# EAGLE design us+h (EAGLE 7.7.0)
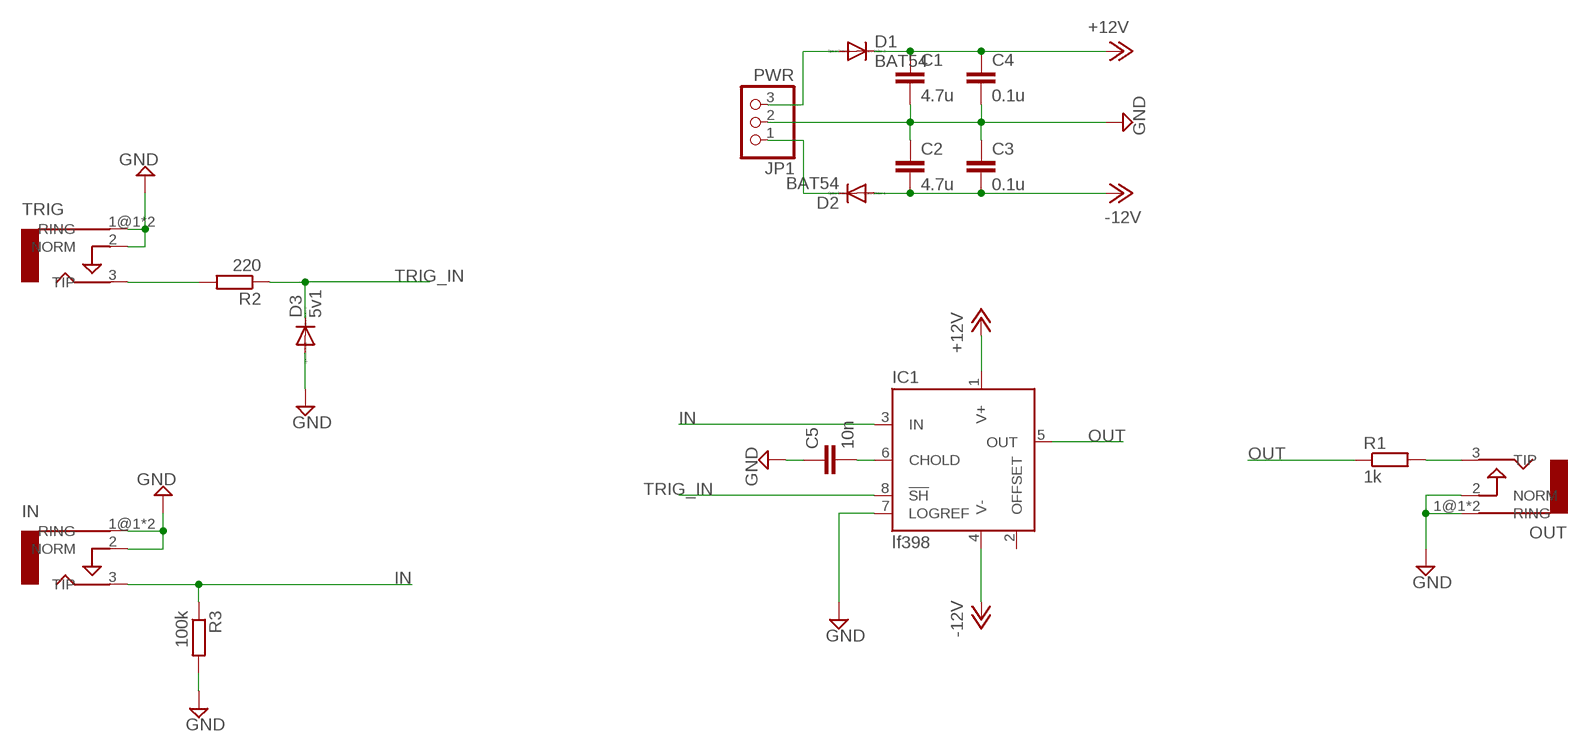
[diagram p0: schematic, sheet 1]

## Parts
C1  4.7u  C-EUC0805  [C0805]
C2  4.7u  C-EUC0805  [C0805]
C3  0.1u  C-EUC0805  [C0805]
C4  0.1u  C-EUC0805  [C0805]
C5  10n  C-EU050-025X075  [C050-025X075]
D1  BAT54  DIODE-SOD323-W  [SOD323-W]
D2  BAT54  DIODE-SOD323-W  [SOD323-W]
D3  5v1  DIODE-SOD323-W  [SOD323-W]
IC1  lf398  LF398AD  [SO08]
IN  in  AUDIO-JACKERTHENVAR  [ERTHENVAR-JACK]
JP1  PWR  PINHD-1X3  [1X03]
OUT  out  AUDIO-JACKERTHENVAR  [ERTHENVAR-JACK]
R1  1k  R-EU_R0805  [R0805]
R2  220  R-EU_R0805  [R0805]
R3  100k  R-EU_R0805  [R0805]
TRIG  trig  AUDIO-JACKERTHENVAR  [ERTHENVAR-JACK]

## Nets
+12: D1.A JP1.3
+12V: C1.1 C4.1 D1.C IC1.1(V+)
-12: D2.C JP1.1
-12V: C2.2 C3.2 D2.A IC1.4(V-)
GND: C1.2 C2.1 C3.1 C4.2 C5.1 D3.A IC1.7(LOGREF) IN.1@1(RING) IN.1@2(RING) IN.2(NORM) JP1.2 OUT.1@1(RING) OUT.1@2(RING) OUT.2(NORM) R3.2 TRIG.1@1(RING) TRIG.1@2(RING) TRIG.2(NORM)
IN: IC1.3(IN) IN.3(TIP) R3.1
N$5: C5.2 IC1.6(CHOLD)
N$6: R2.2 TRIG.3(TIP)
N$8: OUT.3(TIP) R1.2
OUT: IC1.5(OUT) R1.1
TRIG_IN: D3.C IC1.8(!SH) R2.1
Unconnected: IC1.2(OFFSET)

## Library data of the parts
C1-C5 = rcl:C-EU: CAPACITOR, European symbol
D1-D3 = diode:DIODE-: DIODE
IC1 = linear:LF398A: SAMPLE&HOLD AMPLIFIER
IN OUT TRIG = erthenvar:AUDIO-JACK: Switching Mono 3.5mm Audio Jack from Erthenvar.
JP1 = pinhead:PINHD-1X3: PIN HEADER
R1-R3 = rcl:R-EU_: RESISTOR, European symbol

## Board
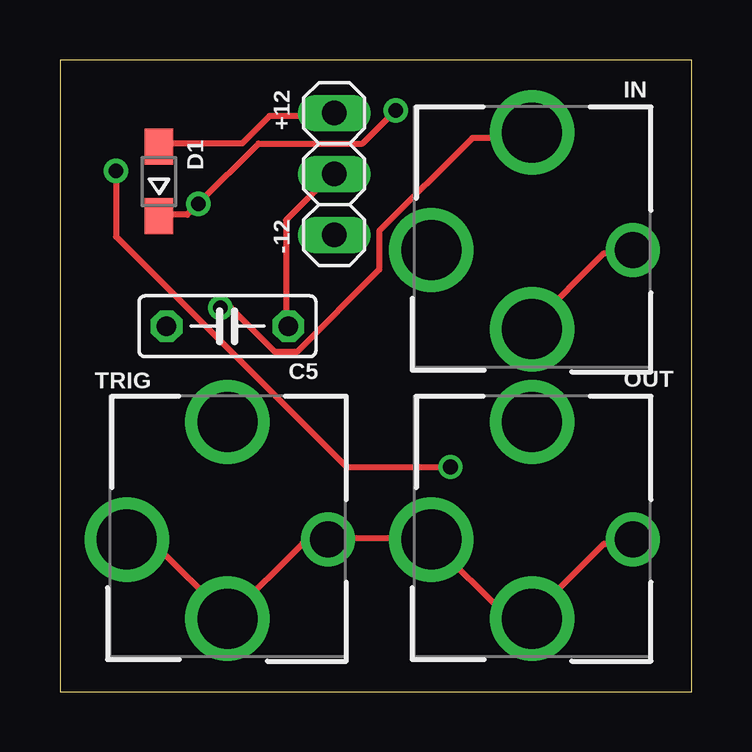
[diagram p1: board, top side]
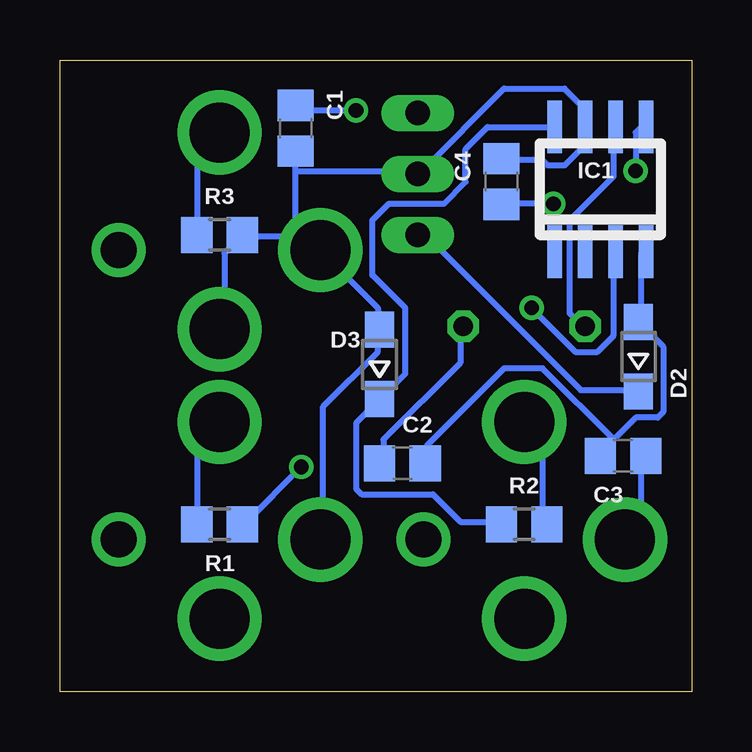
[diagram p2: board, bottom side, seen from below]

Size 26.34 x 26.34 mm. Coordinates in mm from the lower left corner, seen from the top.
Outline: 0,0 26.34,0 26.34,26.34 0,26.34 0,0
Copper layers (1*16): Top 0.035mm / dielectric 1.5mm / Bottom 0.035mm
Design rules "default": minimum track width 10mil, minimum drill 24mil, track to track 8mil, track to pad 8mil, pad to pad 8mil, via to via 8mil, smd to smd 8mil, copper to edge 40mil, drill to drill 8mil, minimum pad ring 10mil, minimum via ring 8mil, stop-mask expansion 4mil, vias tented up to drill 0mil, thermal gap 10mil

### Footprints (pad centres in the part's own frame; a part is rotated, then mirrored left to right if it is on the bottom)
C0805 = smd 1.3 x 1.5: 1 -0.95,0; 2 0.95,0
C050-025X075 = drill 0.813 octagon: 1 -2.54,0; 2 2.54,0
SOD323-W = smd 1.5 x 1.2: A 1.45,0; C -1.45,0
SO08 = smd 0.6 x 2.2: 1 -1.905,-2.6; 2 -0.635,-2.6; 3 0.635,-2.6; 4 1.905,-2.6; 5 1.905,2.6; 6 0.635,2.6; 7 -0.635,2.6; 8 -1.905,2.6
ERTHENVAR-JACK = drill 2.5: 1@1 -4.2,0; 2 0,-3.3; 3 0,4.9 | drill 1.5: 1@2 4.2,0
1X03 = drill 1.016 long: 1 -2.54,0; 2 0,0; 3 2.54,0
R0805 = smd 1.3 x 1.5: 1 -0.95,0; 2 0.95,0

### Placement (x,y rotation side)
C1  16.51,23.5 270 bottom
C2  12.06,9.53 0 bottom
C3  2.86,9.84 180 bottom
C4  7.94,21.27 90 bottom
C5  6.99,15.24 180 top
D1  4.13,21.27 90 top
D2  2.22,13.97 90 bottom
D3  13.02,13.65 90 bottom
IC1  3.81,20.95 0 bottom
IN  19.68,18.41 0 top
JP1  11.43,21.59 90 top
OUT  19.68,6.35 0 top
R1  19.68,6.99 180 bottom
R2  6.99,6.99 0 bottom
R3  19.68,19.05 0 bottom
TRIG  6.99,6.35 0 top

### Tracks (layer width: path | path; a pad name or v marks a point on that pad's centre or on a via)
+12
  Top 0.254: D1.A 4.17,22.86 7.6,22.86 8.74,24 11.25,24 JP1.3
+12V  (via drill 0.61)
  Top 0.254: D1.C 4.17,19.89 5.31,19.89 v5.77,20.34 8.28,22.86 12.62,22.86 v14,24.23
  Bottom 0.254: IC1.1 5.77,18.52 v5.77,20.34 7.82,20.34 C4.1 | v14,24.23 16.51,24.23 C1.1
-12
  Bottom 0.254: D2.C 2.34,12.57 4.62,12.57 11.25,19.2 JP1.1
-12V
  Bottom 0.254: 3.25,10.52 2.34,11.43 1.42,11.43 1.19,11.66 1.19,14.4 2.11,15.32 D2.A 2.11,15.54 2.11,18.29 IC1.4 | 3.25,10.52 3.71,10.06 C3.2 3.25,10.52 | 3.25,10.52 6.22,13.49 7.82,13.49 11.02,10.29 11.02,9.6 C2.2
GND
  Top 0.254: IN.1@2 23.82,18.29 22.68,18.29 19.71,15.32 IN.2 | C5.1 9.42,15.32 9.42,19.66 11.25,21.49 JP1.2 | OUT.1@2 23.82,6.17 22.68,6.17 19.71,3.2 OUT.2 19.48,3.2 18.57,3.2 15.6,6.17 OUT.1@1 15.37,6.4 11.25,6.4 TRIG.1@2 11.02,6.17 10.11,6.17 7.14,3.2 TRIG.2 6.91,3.2 3.94,6.17 2.79,6.17 TRIG.1@1
  Bottom 0.254: C2.1 12.85,9.6 12.85,10.52 9.65,13.72 9.65,15.09 C5.1 | C4.2 7.82,22.17 6.22,22.17 5.99,21.95 5.31,21.95 4.62,22.63 4.62,23.55 IC1.7 4.62,23.77 4.62,24.46 5.31,25.15 7.82,25.15 11.25,21.72 JP1.2 11.48,21.72 16.51,21.72 | IN.1@1 15.37,18.29 13.08,16 13.08,15.32 D3.A 13.08,15.09 13.08,14.17 15.37,11.89 15.37,6.4 OUT.1@1 | 16.51,18.97 16.05,18.97 15.6,18.52 IN.1@1 | 16.51,18.97 18.57,18.97 R3.2 18.8,18.97 19.48,18.29 19.48,15.32 IN.2 | 16.51,18.97 16.51,21.72 | 16.51,21.72 C1.2 | 16.51,18.97 IN.1@1 | C3.1 2.11,9.83 2.11,6.86 2.57,6.4 TRIG.1@1
IN  (via drill 0.61)
  Top 0.254: v6.68,16 7.14,16 8.97,14.17 9.88,14.17 13.31,17.6 13.31,19.2 17.2,23.09 19.48,23.09 IN.3
  Bottom 0.254: R3.1 20.62,19.2 20.62,22.17 19.71,23.09 IN.3 | v6.68,16 4.85,14.17 3.94,14.17 3.25,14.86 3.25,18.29 IC1.3
N$5
  Bottom 0.254: IC1.6 3.25,23.55 3.25,21.49 5.08,19.66 5.08,15.77 4.62,15.32 C5.2
N$6
  Bottom 0.254: R2.2 6.22,7.09 6.22,10.52 6.91,11.2 TRIG.3
N$8
  Bottom 0.254: R1.2 20.62,7.09 20.62,10.29 19.71,11.2 OUT.3
OUT  (via drill 0.61)
  Top 0.254: v16.28,9.37 11.94,9.37 2.34,18.97 v2.34,21.72
  Bottom 0.254: v16.28,9.37 18.57,7.09 R1.1 | v2.34,21.72 2.34,23.32 2.11,23.55 IC1.5
TRIG_IN
  Bottom 0.254: R2.1 8.05,7.09 9.65,7.09 10.79,8.23 13.77,8.23 14,8.46 14,11.2 13.08,12.12 D3.C 12.85,12.34 11.94,13.26 11.94,16 13.31,17.37 13.31,19.66 12.62,20.34 10.34,20.34 9.42,21.26 9.42,22.63 8.51,23.55 5.77,23.55 IC1.8

### Text on the board
tNames: +12 | -12